# Altium project Sub8KillBoard.PrjPcb
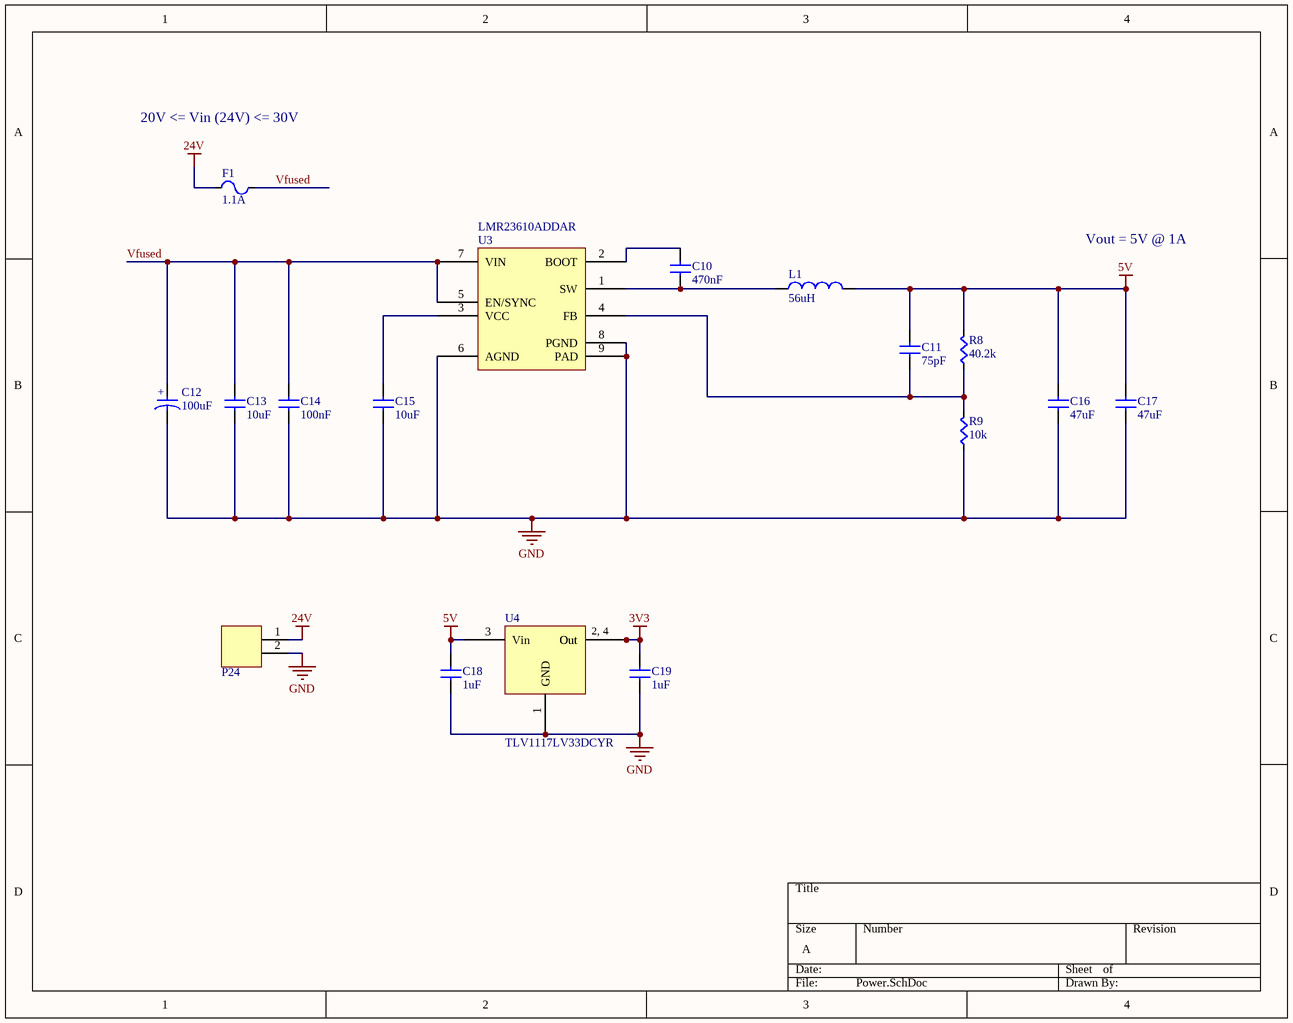
[diagram p0: Power.SchDoc]
4 sheets, 77 parts. Net scope: global (net labels, ports and power ports of the same name join across sheets).
Board file: Sub8KillBoard.PcbDoc
Sheets:
  Power.SchDoc
  Command.SchDoc
  Communication.SchDoc
  Kill.SchDoc

## Sheet Power.SchDoc
size A

### Parts
C10  value 470nF  [CAPC0603]  (hidden comment: Cap)
C11  value 75pF  [CAPC0603]  (hidden comment: Cap)
C12  value 100uF  [EEHZA1H101P]  (hidden comment: EEHZA1H101P)
C13  value 10uF  [CAP1210]  (hidden comment: Cap)
C14  value 100nF  [CAPC0603]  (hidden comment: Cap)
C15  value 10uF  [CAPC0603]  (hidden comment: Cap)
C16  value 47uF  [CAP1210]  (hidden comment: Cap)
C17  value 47uF  [CAP1210]  (hidden comment: Cap)
C18  value 1uF  [CAPC0603]  (hidden comment: Cap)
C19  value 1uF  [CAPC0603]  (hidden comment: Cap)
F1  value 1.1A  [PTC7451X11N]  (hidden comment: PTC Fuse)
L1  value 56uH  [MSS1048-563MLB]  (hidden comment: MSS1048-563MLB)
P24  2-pin Vert Sherlock  [MOLEX-HDR-1X2-SHERLOCK-VERT]  (value not drawn)
R8  value 40.2k  [RES0603]  (hidden comment: Res)
R9  value 10k  [RES0603]  (hidden comment: Res)
U3  LMR23610ADDAR  [LMR23610ADDAR]
U4  TLV1117LV33DCYR  [SOT23-4N]

### Nets
3V3: C19.1(A) U4.2(Out) U4.4(Out)
5V: C11.1(A) C16.1(A) C17.1(A) C18.1(A) L1.2 R8.1(A) U4.3(Vin)
24V: F1.1(A) P24.1
GND: C12.2 C13.2(B) C14.2(B) C15.2(B) C16.2(B) C17.2(B) C18.2(B) C19.2(B) P24.2 R9.2(B) U3.6(AGND) U3.8(PGND) U3.9(PAD) U4.1(GND)
Vfused: C12.1 C13.1(A) C14.1(A) F1.2(B) U3.5(EN/SYNC) U3.7(VIN)
NetC10_1: C10.1(A) U3.2(BOOT)
NetC10_2: C10.2(B) L1.1 U3.1(SW)
NetC11_2: C11.2(B) R8.2(B) R9.1(A) U3.4(FB)
NetC15_1: C15.1(A) U3.3(VCC)

### Notes on the sheet
- 20V <= Vin (24V) <= 30V
- Vout = 5V @ 1A
- (in symbol EEHZA1H101P) +
- (in symbol TLV1117LV33DCYR) 2, 4

### Library data of the parts
C12 = EEHZA1H101P: CAP ALUM POLY HYB 100UF 50V SMD; Manufacturer 1: Panasonic; Tolerance: 20%; Supplier 1: Digi-Key; Supplier Part Number 1: P15442CT-ND; Manufacturer Part Number 1: EEHZA1H101P; Voltage: 50V; ComponentLink1URL: https://na.industrial.panasonic.com/products/capacitors/aluminum-electrolytic-capacitors/conductive-polymer-hybrid-aluminum-electrolytic/series/za-high-temp-reflow/ABA0135/model/EEHZA1H101P; ComponentLink1Description: Web Site; ComponentLink2URL: https://industrial.panasonic.com/cdbs/www-data/pdf/RDD0000/ABA0000C1221.pdf; ComponentLink2Description: Data Sheet; ComponentLink3URL: https://industrial.panasonic.com/cdbs/www-data/pdf/RDD0000/ABA0000COS44.pdf; ComponentLink3Description: ZA Series Technical Data
C18 C19 = Cap: Manufacturer Part Number: C0603C105K8PACTU; Supplier 1: Digi-Key; Supplier Part Number 1: 399-3118-1-ND
F1 = PTC_Fuse: Supplier 1: Digi-Key; Supplier Part Number 1: 507-1744-1-ND
L1 = MSS1048-563MLB: FIXED IND 56UH 1.7A 126 MOHM; Manufacturer 1: Coilcraft; Manufacturer Part Number 1: MSS1048-563MLB; ComponentLink1Description: Web Site; ComponentLink1URL: https://www.coilcraft.com/mss1048.cfm; Supplier 1: Coilcraft; Supplier Part Number 1: MSS1048-563MLB
P24 = MOLEX-HDR-1x2-SHERLOCK_VERT: Header, Molex, 2mm Pitch Sherlock Header, Single Row, Vertical, 2 Circuits, Length 3.3mm, 0353620250; Manufacturer Part Number: *; Order Part Number: *
U3 = LMR23610ADDAR: IC REG BUCK ADJ 1A SYNC 8SOPWRPD; Manufacturer 1: Texas Instruments; Supplier 1: Digi-Key; Supplier Part Number 1: 296-47267-1-ND; Manufacturer Part Number 1: LMR23610ADDAR; ComponentLink1URL: http://www.ti.com/lit/ds/symlink/lmr23610.pdf; ComponentLink1Description: Datasheet; ComponentLink2URL: http://www.ti.com/product/LMR23610/description; ComponentLink2Description: Web Site
U4 = TLV1117LV33DCYR: IC REG LINEAR 3.3V 1A SOT223-4; Digi-Key Part Number: 296-28778-1-ND
C10 C11 C13-C17 = Cap: Supplier 1: Digi-Key
  C14: Supplier Part Number 1: 1276-1000-1-ND
  C16 C17: Supplier Part Number 1: 490-6538-1-ND
R8 R9 = Res: Supplier 1: Digi-Key
  R8: Supplier Part Number 1: RMCF0603FT40K2CT-ND
  R9: Supplier Part Number 1: RMCF0603JT10K0CT-ND

## Sheet Command.SchDoc
size A
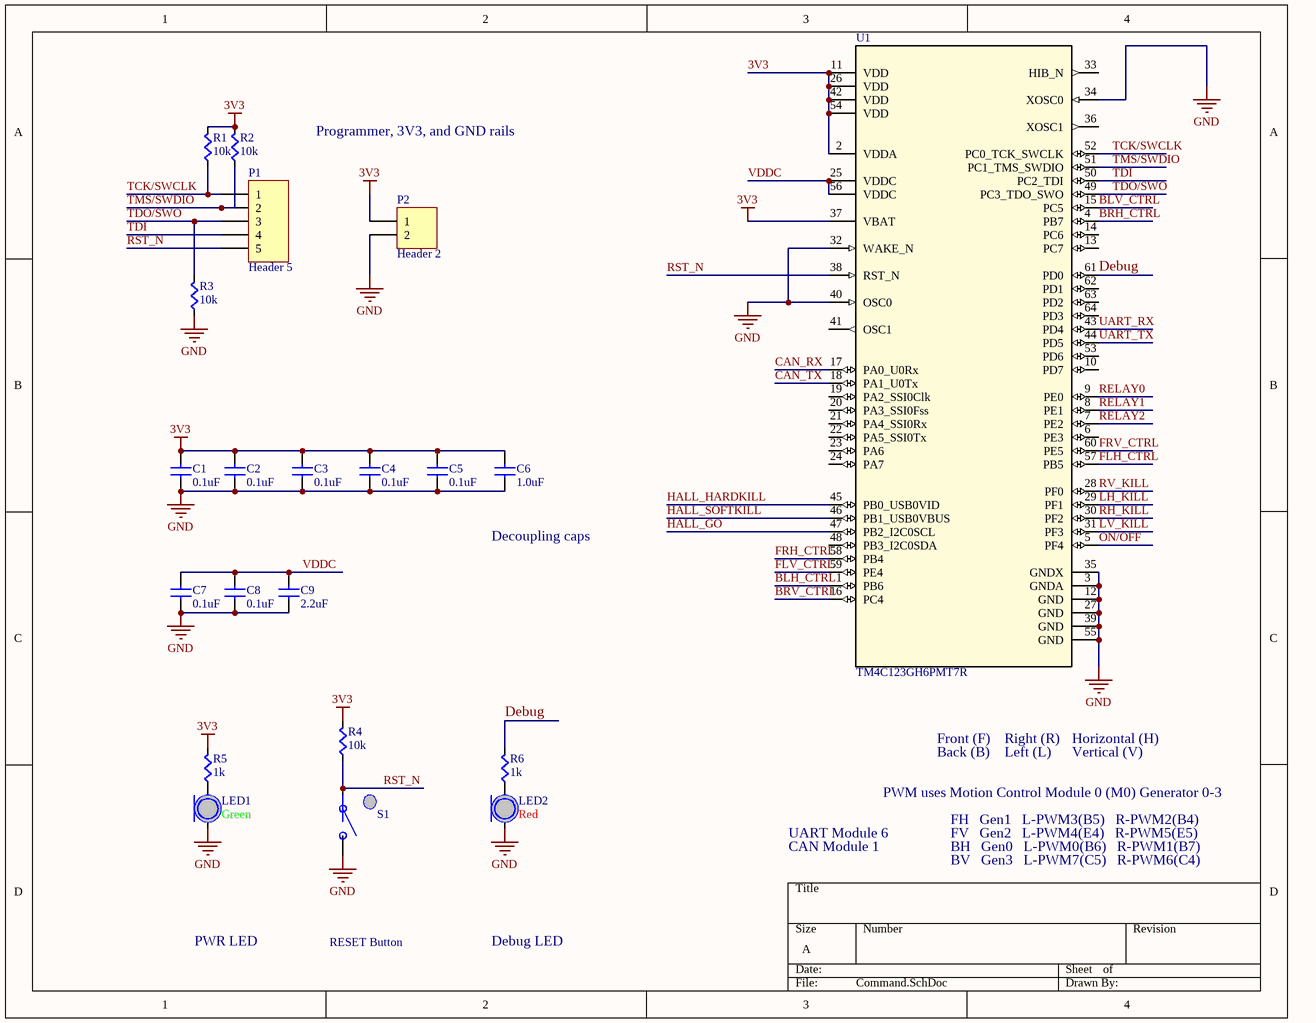
[diagram p1: Command.SchDoc]

### Parts
C1  value 0.1uF  [CAPC0603]  (hidden comment: Cap)
C2  value 0.1uF  [CAPC0603]  (hidden comment: Cap)
C3  value 0.1uF  [CAPC0603]  (hidden comment: Cap)
C4  value 0.1uF  [CAPC0603]  (hidden comment: Cap)
C5  value 0.1uF  [CAPC0603]  (hidden comment: Cap)
C6  value 1.0uF  [CAPC0603]  (hidden comment: Cap)
C7  value 0.1uF  [CAPC0603]  (hidden comment: Cap)
C8  value 0.1uF  [CAPC0603]  (hidden comment: Cap)
C9  value 2.2uF  [CAPC0603]  (hidden comment: Cap)
LED1  Color: Green  [LED0603]  (hidden comment: LED)
LED2  Color: Red  [LED0603]  (hidden comment: LED)
P1  Header 5  [HDR1X5]
P2  Header 2  [HDR1X2]
R1  value 10k  [RES0603]  (hidden comment: Res)
R2  value 10k  [RES0603]  (hidden comment: Res)
R3  value 10k  [RES0603]  (hidden comment: Res)
R4  value 10k  [RES0603]  (hidden comment: Res)
R5  value 1k  [RES0603]  (hidden comment: Res)
R6  value 1k  [RES0603]  (hidden comment: Res)
S1  Button  [PTS645xxxxSMTR92]  (value not drawn)
U1  TM4C123GH6PMT7R  [TM4C123GH6PMT7R_M]

### Nets
3V3: C1.1(A) C2.1(A) C3.1(A) C4.1(A) C5.1(A) C6.1(A) P2.1 R1.1(A) R2.1(A) R4.1(A) R5.1(A) U1.2(VDDA) U1.11(VDD) U1.26(VDD) U1.37(VBAT) U1.42(VDD) U1.54(VDD)
GND: C1.2(B) C2.2(B) C3.2(B) C4.2(B) C5.2(B) C6.2(B) C7.2(B) C8.2(B) C9.2(B) LED1.C LED2.C P2.2 R3.2(B) S1.B U1.3(GNDA) U1.12(GND) U1.27(GND) U1.32(WAKE_N) U1.34(XOSC0) U1.35(GNDX) U1.39(GND) U1.40(OSC0) U1.55(GND)
BLH_CTRL: U1.1(PB6)
BLV_CTRL: U1.15(PC5)
BRH_CTRL: U1.4(PB7)
BRV_CTRL: U1.16(PC4)
CAN_RX: U1.17(PA0_U0Rx)
CAN_TX: U1.18(PA1_U0Tx)
Debug: R6.1(A) U1.61(PD0)
FLH_CTRL: U1.57(PB5)
FLV_CTRL: U1.59(PE4)
FRH_CTRL: U1.58(PB4)
FRV_CTRL: U1.60(PE5)
HALL_GO: U1.47(PB2_I2C0SCL)
HALL_HARDKILL: U1.45(PB0_USB0VID)
HALL_SOFTKILL: U1.46(PB1_USB0VBUS)
LH_KILL: U1.29(PF1)
LV_KILL: U1.31(PF3)
ON/OFF: U1.5(PF4)
RELAY0: U1.9(PE0)
RELAY1: U1.8(PE1)
RELAY2: U1.7(PE2)
RH_KILL: U1.30(PF2)
RST_N: P1.5 R4.2(B) S1.A U1.38(RST_N)
RV_KILL: U1.28(PF0)
TCK/SWCLK: P1.1 R1.2(B) U1.52(PC0_TCK_SWCLK)
TDI: P1.4 U1.50(PC2_TDI)
TDO/SWO: P1.3 R3.1(A) U1.49(PC3_TDO_SWO)
TMS/SWDIO: P1.2 R2.2(B) U1.51(PC1_TMS_SWDIO)
UART_RX: U1.43(PD4)
UART_TX: U1.44(PD5)
VDDC: C7.1(A) C8.1(A) C9.1(A) U1.25(VDDC) U1.56(VDDC)
NetLED1_A: LED1.A R5.2(B)
NetLED2_A: LED2.A R6.2(B)

Not connected (* = marked no-connect by the designer): U1 6(PE3) 10(PD7) 13(PC7) 14(PC6) 19(PA2_SSI0Clk) 20(PA3_SSI0Fss) 21(PA4_SSI0Rx) 22(PA5_SSI0Tx) 23(PA6) 24(PA7) 33(HIB_N) 36(XOSC1) 41(OSC1) 48(PB3_I2C0SDA) 53(PD6) 62(PD1) 63(PD2) 64(PD3)

### Notes on the sheet
- Programmer, 3V3, and GND rails
- Decoupling caps
- Front (F)
- Back (B)
- Right (R)
- Left (L)
- Horizontal (H)
- Vertical (V)
- UART Module 6
- PWM uses Motion Control Module 0 (M0) Generator 0-3
- FH   Gen1   L-PWM3(B5)   R-PWM2(B4)
- FV   Gen2   L-PWM4(E4)   R-PWM5(E5)
- CAN Module 1
- BH   Gen0   L-PWM0(B6)   R-PWM1(B7)
- BV   Gen3   L-PWM7(C5)   R-PWM6(C4)
- PWR LED
- RESET Button
- Debug LED

### Library data of the parts
P1 = Header 5: Header, 5-Pin; LatestRevisionDate: 17-Jul-2002; LatestRevisionNote: Re-released for DXP Platform.; Publisher: Altium Limited
P2 = Header 2: Header, 2-Pin; LatestRevisionDate: 17-Jul-2002; LatestRevisionNote: Re-released for DXP Platform.; Publisher: Altium Limited
S1 = Button: SPST Button; Supplier 1: Digi-Key; Supplier Part Number 1: CKN9087CT-ND
U1 = TM4C123GH6PMT7R: Imported; PartNumber: TM4C123GH6PMTR; Manufacturer: Texas Instruments; CompType: IC; PIN_COUNT: 64; Application_BuildNumber: *; Alternate_PartNumber: TM4C123GH6PMT; PackageReference: PM0064A; MountType: SMT; RoHS: Y; RefDes: RefDes; TYPE: TYPE; Value: Value
C1-C9 = Cap: Supplier 1: Digi-Key; Supplier Part Number 1: 1276-1000-1-ND
LED1 LED2 = LED: Supplier 1: Digi-Key; Supplier Part Number 1: 754-1122-1-ND
R1-R6 = Res: Supplier 1: Digi-Key; Supplier Part Number 1: RMCF0603JT10K0CT-ND

## Sheet Communication.SchDoc
size A
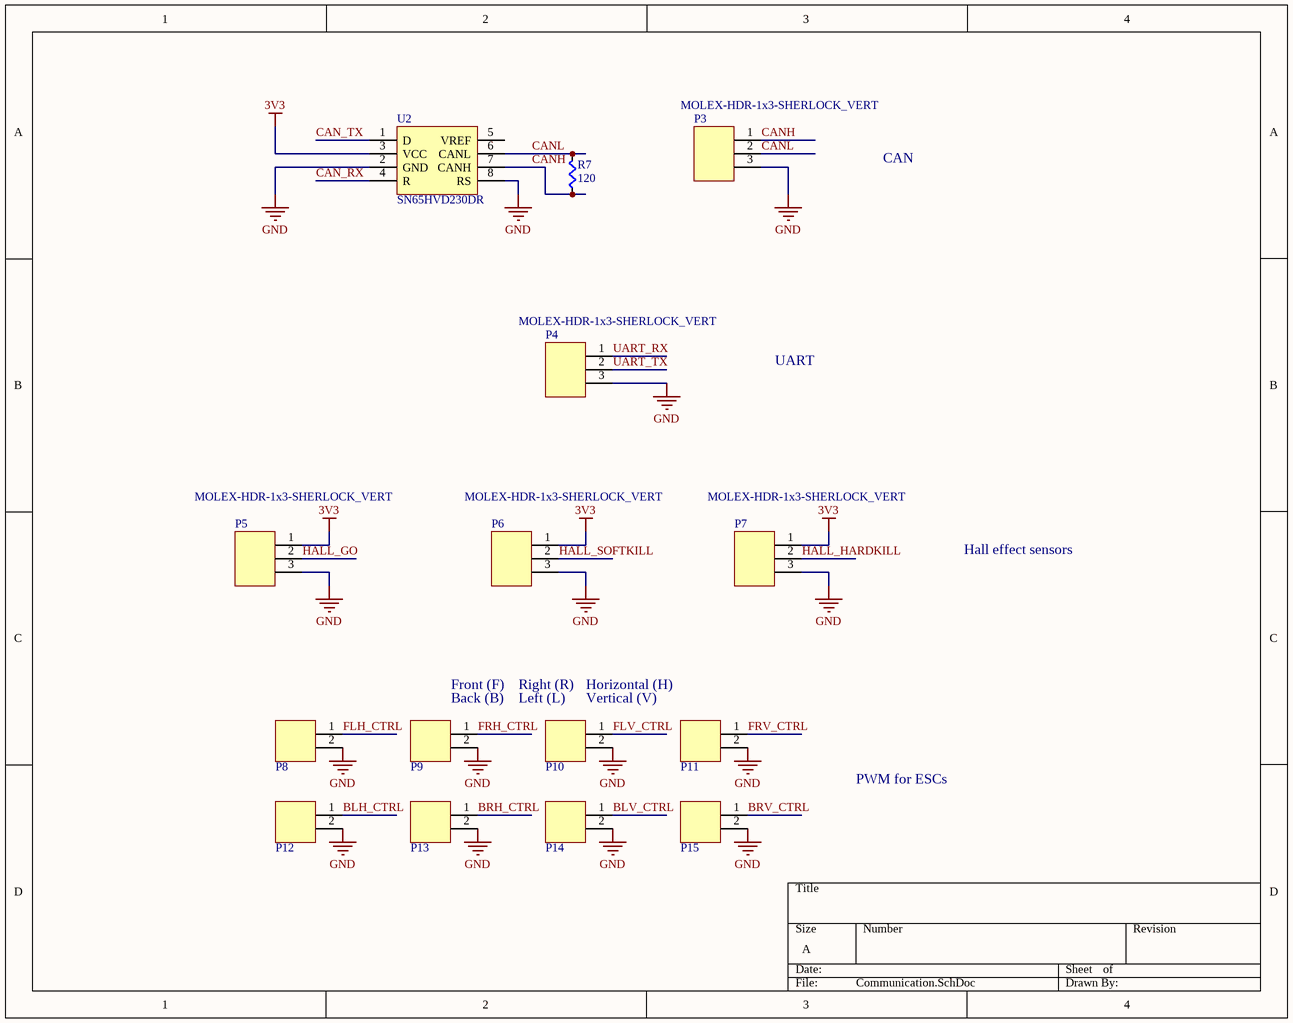
[diagram p2: Communication.SchDoc]

### Parts
P3  MOLEX-HDR-1x3-SHERLOCK_VERT  [MOLEX-HDR-1X3-SHERLOCK-VERT]
P4  MOLEX-HDR-1x3-SHERLOCK_VERT  [MOLEX-HDR-1X3-SHERLOCK-VERT]
P5  MOLEX-HDR-1x3-SHERLOCK_VERT  [MOLEX-HDR-1X3-SHERLOCK-VERT]
P6  MOLEX-HDR-1x3-SHERLOCK_VERT  [MOLEX-HDR-1X3-SHERLOCK-VERT]
P7  MOLEX-HDR-1x3-SHERLOCK_VERT  [MOLEX-HDR-1X3-SHERLOCK-VERT]
P8  2-pin Vert Sherlock  [MOLEX-HDR-1X2-SHERLOCK-VERT]  (value not drawn)
P9  2-pin Vert Sherlock  [MOLEX-HDR-1X2-SHERLOCK-VERT]  (value not drawn)
P10  2-pin Vert Sherlock  [MOLEX-HDR-1X2-SHERLOCK-VERT]  (value not drawn)
P11  2-pin Vert Sherlock  [MOLEX-HDR-1X2-SHERLOCK-VERT]  (value not drawn)
P12  2-pin Vert Sherlock  [MOLEX-HDR-1X2-SHERLOCK-VERT]  (value not drawn)
P13  2-pin Vert Sherlock  [MOLEX-HDR-1X2-SHERLOCK-VERT]  (value not drawn)
P14  2-pin Vert Sherlock  [MOLEX-HDR-1X2-SHERLOCK-VERT]  (value not drawn)
P15  2-pin Vert Sherlock  [MOLEX-HDR-1X2-SHERLOCK-VERT]  (value not drawn)
R7  value 120  [RES0603]  (hidden comment: Res)
U2  SN65HVD230DR  [SOIC-8pin]

### Nets
3V3: P5.1 P6.1 P7.1 U2.3(VCC)
GND: P3.3 P4.3 P5.3 P6.3 P7.3 P8.2 P9.2 P10.2 P11.2 P12.2 P13.2 P14.2 P15.2 U2.2(GND) U2.8(RS)
BLH_CTRL: P12.1
BLV_CTRL: P14.1
BRH_CTRL: P13.1
BRV_CTRL: P15.1
CAN_RX: U2.4(R)
CAN_TX: U2.1(D)
CANH: P3.1 R7.2(B) U2.7(CANH)
CANL: P3.2 R7.1(A) U2.6(CANL)
FLH_CTRL: P8.1
FLV_CTRL: P10.1
FRH_CTRL: P9.1
FRV_CTRL: P11.1
HALL_GO: P5.2
HALL_HARDKILL: P7.2
HALL_SOFTKILL: P6.2
UART_RX: P4.1
UART_TX: P4.2

Not connected (* = marked no-connect by the designer): U2 5(VREF)

### Notes on the sheet
- CAN
- UART
- Hall effect sensors
- (near P9) Front (F)
- (near P9) Back (B)
- (near P10) Right (R)
- (near P10) Left (L)
- Horizontal (H)
- (near P10) Vertical (V)
- PWM for ESCs

### Library data of the parts
P3-P7 = MOLEX-HDR-1x3-SHERLOCK_VERT: Header, Molex, 2mm Pitch Sherlock Header, Single Row, Vertical, 3 Circuits, Length 3.3mm, 0353620376; Manufacturer Part Number: *; Order Part Number: *
P8-P15 = MOLEX-HDR-1x2-SHERLOCK_VERT: as P24 on sheet Power; Manufacturer Part Number: *; Order Part Number: *
U2 = SN65HVD230DR: 3.3V CAN Bus Transciever
R7 = Res: Supplier 1: Digi-Key

## Sheet Kill.SchDoc
size A
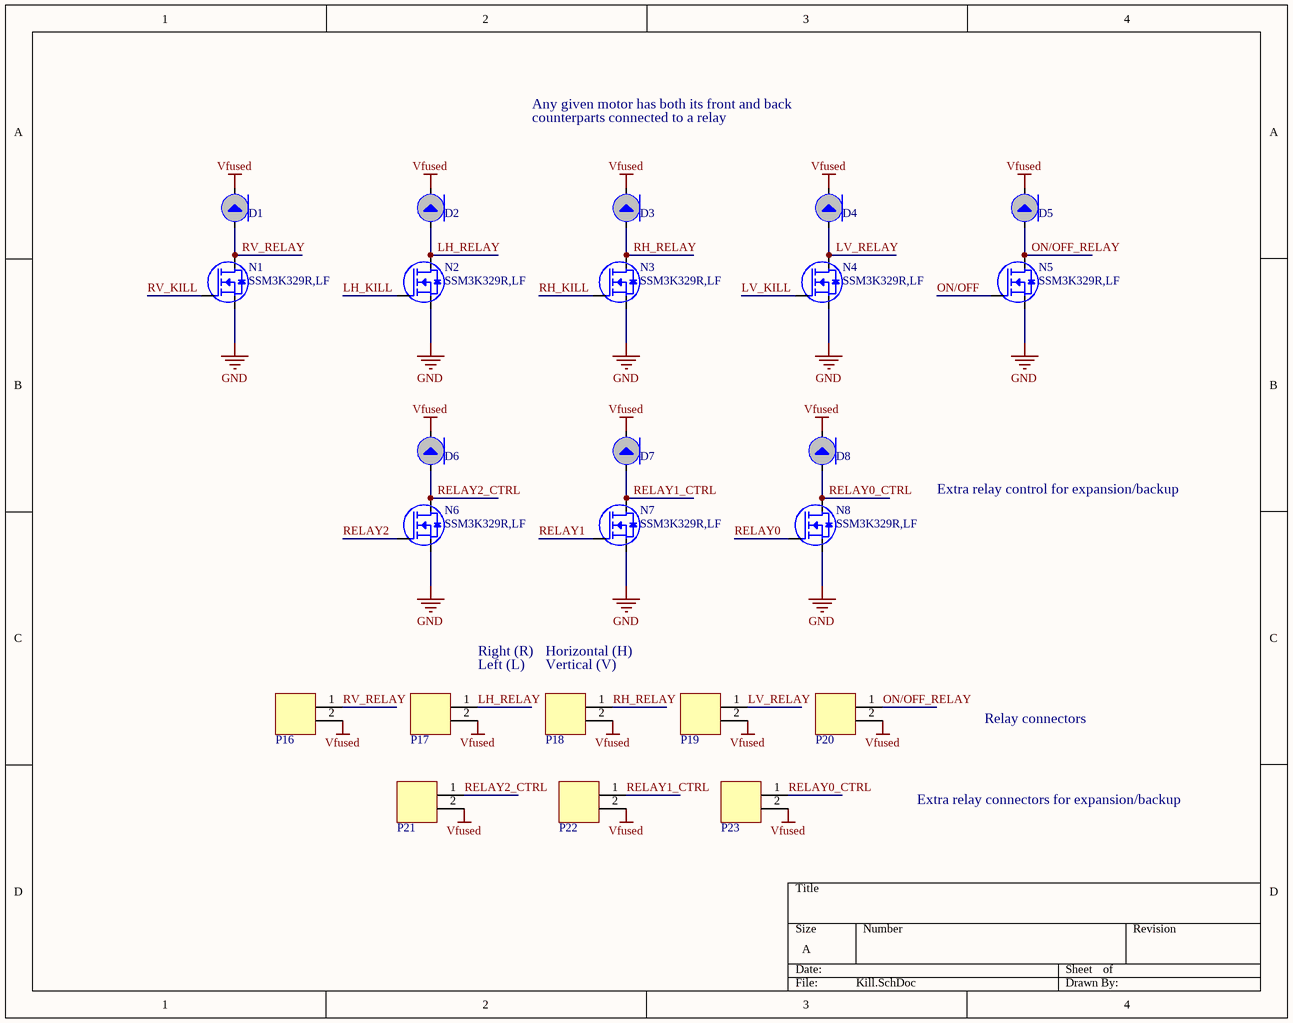
[diagram p3: Kill.SchDoc]

### Parts
D1  Diode  [TEMD5510FX01]  (value not drawn)
D2  Diode  [TEMD5510FX01]  (value not drawn)
D3  Diode  [TEMD5510FX01]  (value not drawn)
D4  Diode  [TEMD5510FX01]  (value not drawn)
D5  Diode  [TEMD5510FX01]  (value not drawn)
D6  Diode  [TEMD5510FX01]  (value not drawn)
D7  Diode  [TEMD5510FX01]  (value not drawn)
D8  Diode  [TEMD5510FX01]  (value not drawn)
N1  SSM3K329R,LF  [SSM3K329R,LF]
N2  SSM3K329R,LF  [SSM3K329R,LF]
N3  SSM3K329R,LF  [SSM3K329R,LF]
N4  SSM3K329R,LF  [SSM3K329R,LF]
N5  SSM3K329R,LF  [SSM3K329R,LF]
N6  SSM3K329R,LF  [SSM3K329R,LF]
N7  SSM3K329R,LF  [SSM3K329R,LF]
N8  SSM3K329R,LF  [SSM3K329R,LF]
P16  2-pin Vert Sherlock  [MOLEX-HDR-1X2-SHERLOCK-VERT]  (value not drawn)
P17  2-pin Vert Sherlock  [MOLEX-HDR-1X2-SHERLOCK-VERT]  (value not drawn)
P18  2-pin Vert Sherlock  [MOLEX-HDR-1X2-SHERLOCK-VERT]  (value not drawn)
P19  2-pin Vert Sherlock  [MOLEX-HDR-1X2-SHERLOCK-VERT]  (value not drawn)
P20  2-pin Vert Sherlock  [MOLEX-HDR-1X2-SHERLOCK-VERT]  (value not drawn)
P21  2-pin Vert Sherlock  [MOLEX-HDR-1X2-SHERLOCK-VERT]  (value not drawn)
P22  2-pin Vert Sherlock  [MOLEX-HDR-1X2-SHERLOCK-VERT]  (value not drawn)
P23  2-pin Vert Sherlock  [MOLEX-HDR-1X2-SHERLOCK-VERT]  (value not drawn)

### Nets
GND: N1.2(S) N2.2(S) N3.2(S) N4.2(S) N5.2(S) N6.2(S) N7.2(S) N8.2(S)
Vfused: D1.C D2.C D3.C D4.C D5.C D6.C D7.C D8.C P16.2 P17.2 P18.2 P19.2 P20.2 P21.2 P22.2 P23.2
LH_KILL: N2.1(G)
LH_RELAY: D2.A N2.3(D) P17.1
LV_KILL: N4.1(G)
LV_RELAY: D4.A N4.3(D) P19.1
ON/OFF: N5.1(G)
ON/OFF_RELAY: D5.A N5.3(D) P20.1
RELAY0: N8.1(G)
RELAY0_CTRL: D8.A N8.3(D) P23.1
RELAY1: N7.1(G)
RELAY1_CTRL: D7.A N7.3(D) P22.1
RELAY2: N6.1(G)
RELAY2_CTRL: D6.A N6.3(D) P21.1
RH_KILL: N3.1(G)
RH_RELAY: D3.A N3.3(D) P18.1
RV_KILL: N1.1(G)
RV_RELAY: D1.A N1.3(D) P16.1

### Notes on the sheet
- Any given motor has both its front and back
- counterparts connected to a relay
- Extra relay control for expansion/backup
- Right (R)
- Left (L)
- (near P18) Horizontal (H)
- (near P18) Vertical (V)
- Relay connectors
- Extra relay connectors for expansion/backup

### Library data of the parts
D1-D8 = Diode: Standard Diode Template
N1-N8 = SSM3K329R,LF: MOSFET N CH 30V 3.5A 2-3Z1A; Manufacturer 1: Toshiba Semiconductor and Storage; Supplier 1: Digi-Key; Supplier Part Number 1: SSM3K329RLFTR-ND; Manufacturer Part Number 1: SSM3K329R,LF
P16-P23 = MOLEX-HDR-1x2-SHERLOCK_VERT: as P24 on sheet Power; Manufacturer Part Number: *; Order Part Number: *

## Nets that join several sheets
3V3: Power (C19.1 U4.2 U4.4), Command (17 pins), Communication (P5.1 P6.1 P7.1 U2.3)
GND: Power (14 pins), Command (23 pins), Communication (15 pins), Kill (8 pins)
Vfused: Power (6 pins), Kill (16 pins)
BLH_CTRL: Command (U1.1), Communication (P12.1)
BLV_CTRL: Command (U1.15), Communication (P14.1)
BRH_CTRL: Command (U1.4), Communication (P13.1)
BRV_CTRL: Command (U1.16), Communication (P15.1)
CAN_RX: Command (U1.17), Communication (U2.4)
CAN_TX: Command (U1.18), Communication (U2.1)
FLH_CTRL: Command (U1.57), Communication (P8.1)
FLV_CTRL: Command (U1.59), Communication (P10.1)
FRH_CTRL: Command (U1.58), Communication (P9.1)
FRV_CTRL: Command (U1.60), Communication (P11.1)
HALL_GO: Command (U1.47), Communication (P5.2)
HALL_HARDKILL: Command (U1.45), Communication (P7.2)
HALL_SOFTKILL: Command (U1.46), Communication (P6.2)
LH_KILL: Command (U1.29), Kill (N2.1)
LV_KILL: Command (U1.31), Kill (N4.1)
ON/OFF: Command (U1.5), Kill (N5.1)
RELAY0: Command (U1.9), Kill (N8.1)
RELAY1: Command (U1.8), Kill (N7.1)
RELAY2: Command (U1.7), Kill (N6.1)
RH_KILL: Command (U1.30), Kill (N3.1)
RV_KILL: Command (U1.28), Kill (N1.1)
UART_RX: Command (U1.43), Communication (P4.1)
UART_TX: Command (U1.44), Communication (P4.2)